# EAGLE design batteryBalancer (EAGLE 8.4.0)
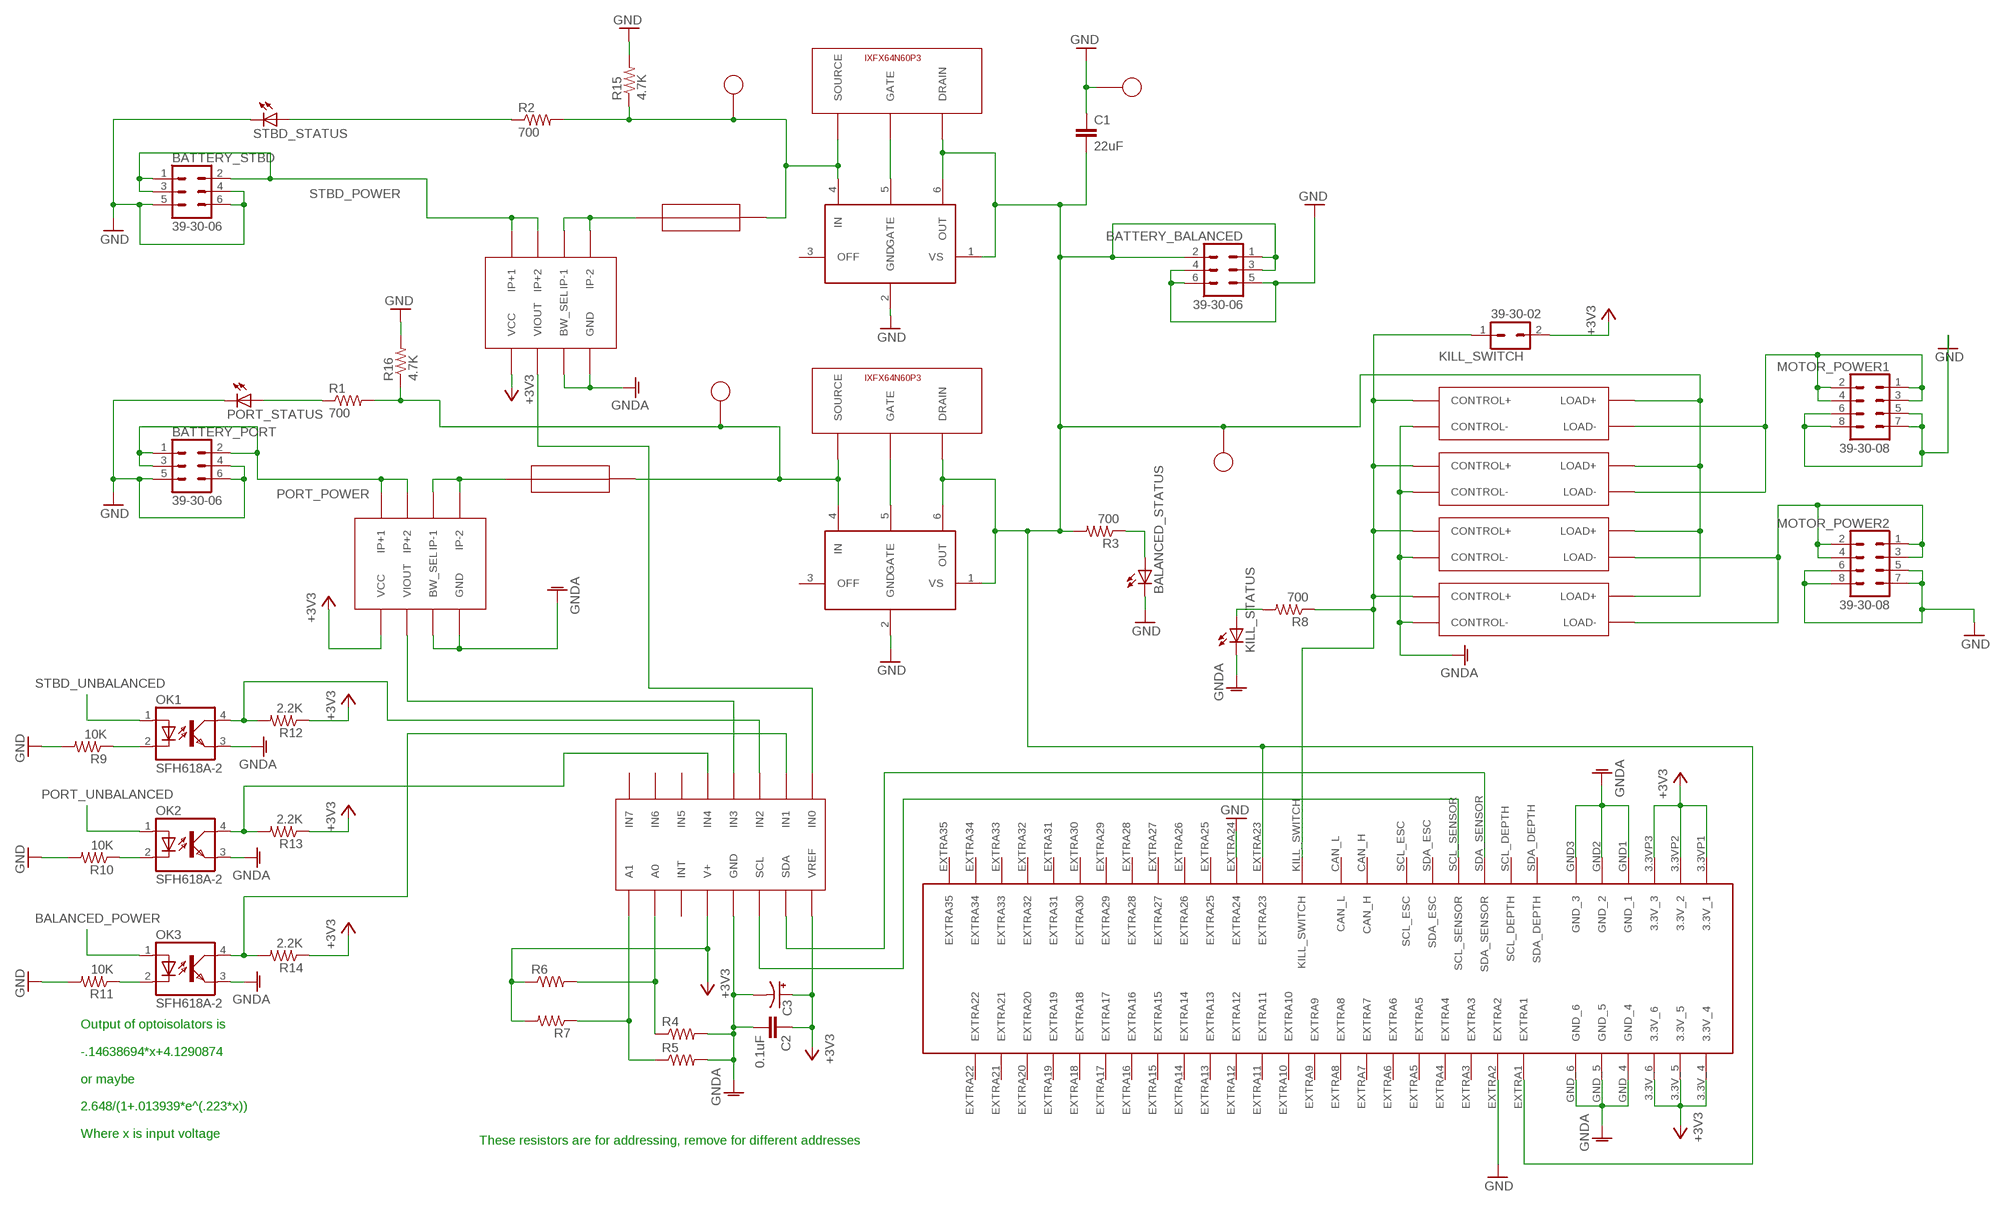
[diagram p0: schematic, sheet 1]

## Parts
ADC  ADC128D818  [TSSOP-16]
BALANCED_STATUS  LTST-S270GKT  [LTST-S270GKT]
BATTERY_BALANCED  39-30-06  [39-30-?06?]
BATTERY_PORT  39-30-06  [39-30-?06?]
BATTERY_STBD  39-30-06  [39-30-?06?]
C1  22uF  0.1UF-KIT-EZ-50V-20%  [CAP-PTH-SMALL-KIT]
C2  0.1uF  0.1UF-KIT-EZ-50V-20%  [CAP-PTH-SMALL-KIT]
C3  CPOL-USE2-4  [E2-4]
EDGE_CONNECTOR  5530843  [5530843-6-BOARDFINGERS]
KILL_STATUS  LTST-S270GKT  [LTST-S270GKT]
KILL_SWITCH  39-30-02  [39-30-?02?]
MOTOR_POWER1  39-30-08  [39-30-?08?]
MOTOR_POWER2  39-30-08  [39-30-?08?]
OK1  SFH618A-2  [DIP4]
OK2  SFH618A-2  [DIP4]
OK3  SFH618A-2  [DIP4]
PORT_CS  ACS722  [SOIC-8]
PORT_FC  LM5050-1  [SOT23-6]
PORT_FET  IXFX64N60P3  [IXFX64N60P3]
PORT_FUSE  01220083Z  [01220083Z]
PORT_STATUS  LTST-S270GKT  [LTST-S270GKT]
R1  700  R-US_0207/7  [0207/7]
R2  700  R-US_0207/7  [0207/7]
R3  700  R-US_0207/7  [0207/7]
R4  R-US_0204/5  [0204/5]
R5  R-US_0204/5  [0204/5]
R6  R-US_0204/5  [0204/5]
R7  R-US_0204/5  [0204/5]
R8  700  R-US_0207/7  [0207/7]
R9  10K  R-US_0207/7  [0207/7]
R10  10K  R-US_0207/7  [0207/7]
R11  10K  R-US_0207/7  [0207/7]
R12  2.2K  R-US_0207/7  [0207/7]
R13  2.2K  R-US_0207/7  [0207/7]
R14  2.2K  R-US_0207/7  [0207/7]
R15  4.7K  R-US_0207/7  [0207/7]
R16  4.7K  R-US_0207/7  [0207/7]
RELAY2  CMX60D20  [CMX60D20]
RELAY3  CMX60D20  [CMX60D20]
RELAY4  CMX60D20  [CMX60D20]
RLAY1  CMX60D20  [CMX60D20]
STBD_CS  ACS722  [SOIC-8]
STBD_FC  LM5050-1  [SOT23-6]
STBD_FET  IXFX64N60P3  [IXFX64N60P3]
STBD_FUSE  01220083Z  [01220083Z]
STBD_STATUS  LTST-S270GKT  [LTST-S270GKT]
U$1  5010_C  [5010_C]
U$2  5010_C  [5010_C]
U$3  5010_C  [5010_C]
U$4  5010_C  [5010_C]

## Nets
3.3V: ADC.V+ ADC.VREF C2.1 C3.+ EDGE_CONNECTOR.3.3V_4 EDGE_CONNECTOR.3.3V_5 EDGE_CONNECTOR.3.3V_6 EDGE_CONNECTOR.3.3VP1(3.3V_1) EDGE_CONNECTOR.3.3VP2(3.3V_2) EDGE_CONNECTOR.3.3VP3(3.3V_3) KILL_SWITCH.2 PORT_CS.VCC R6.1 R7.2 R12.1 R13.1 R14.1 STBD_CS.VCC ; supply symbol labelled +3V3
ADC_A0: ADC.A0 R4.1 R6.2
ADC_A1: ADC.A1 R5.1 R7.1
BALANCED_INDICATOR: BALANCED_STATUS.ANODE(A) R3.1
BALANCED_LOGIC: ADC.IN1 OK3.4(COL) R14.2
BALANCED_OPTO_NEG: OK3.2(C) R11.1
BALANCED_POWER: BATTERY_BALANCED.1 BATTERY_BALANCED.2 BATTERY_BALANCED.3 C1.2 EDGE_CONNECTOR.EXTRA1 EDGE_CONNECTOR.EXTRA23 OK3.1(A) PORT_FC.1(VS) PORT_FC.6(OUT) PORT_FET.DRAIN R3.2 RELAY2.LOAD+ RELAY3.LOAD+ RELAY4.LOAD+ RLAY1.LOAD+ STBD_FC.1(VS) STBD_FC.6(OUT) STBD_FET.DRAIN U$3.P$1
GND: BALANCED_STATUS.CATHODE(C) BATTERY_BALANCED.4 BATTERY_BALANCED.5 BATTERY_BALANCED.6 BATTERY_PORT.4 BATTERY_PORT.5 BATTERY_PORT.6 BATTERY_STBD.4 BATTERY_STBD.5 BATTERY_STBD.6 C1.1 EDGE_CONNECTOR.EXTRA2 EDGE_CONNECTOR.EXTRA24 MOTOR_POWER1.5 MOTOR_POWER1.6 MOTOR_POWER1.7 MOTOR_POWER1.8 MOTOR_POWER2.5 MOTOR_POWER2.6 MOTOR_POWER2.7 MOTOR_POWER2.8 PORT_FC.2(GND) PORT_STATUS.CATHODE(C) R9.2 R10.2 R11.2 R15.2 R16.2 STBD_FC.2(GND) STBD_STATUS.CATHODE(C) U$4.P$1
KILL_SWITCH: EDGE_CONNECTOR.KILL_SWITCH KILL_SWITCH.1 R8.1 RELAY2.CONTROL+ RELAY3.CONTROL+ RELAY4.CONTROL+ RLAY1.CONTROL+
LOGIC_GND: ADC.GND C2.2 C3.- EDGE_CONNECTOR.GND1(GND_1) EDGE_CONNECTOR.GND2(GND_2) EDGE_CONNECTOR.GND3(GND_3) EDGE_CONNECTOR.GND_4 EDGE_CONNECTOR.GND_5 EDGE_CONNECTOR.GND_6 KILL_STATUS.CATHODE(C) OK1.3(EMIT) OK2.3(EMIT) OK3.3(EMIT) PORT_CS.BW_SEL PORT_CS.GND R4.2 R5.2 RELAY2.CONTROL- RELAY3.CONTROL- RELAY4.CONTROL- RLAY1.CONTROL- STBD_CS.BW_SEL STBD_CS.GND ; supply symbol labelled GNDA
MOTOR_POWER1: MOTOR_POWER1.1 MOTOR_POWER1.2 MOTOR_POWER1.3 MOTOR_POWER1.4 RELAY2.LOAD- RLAY1.LOAD-
MOTOR_POWER2: MOTOR_POWER2.1 MOTOR_POWER2.2 MOTOR_POWER2.3 MOTOR_POWER2.4 RELAY3.LOAD- RELAY4.LOAD-
N$3: KILL_STATUS.ANODE(A) R8.2
PORT_CURRENT: ADC.IN3 PORT_CS.VIOUT
PORT_GATE: PORT_FC.5(GATE) PORT_FET.GATE
PORT_LOGIC: ADC.IN4 OK2.4(COL) R13.2
PORT_OPTO_NEG: OK2.2(C) R10.1
PORT_POWER: BATTERY_PORT.1 BATTERY_PORT.2 BATTERY_PORT.3 PORT_CS.IP+1 PORT_CS.IP+2
PORT_STATUS: PORT_STATUS.ANODE(A) R1.1
PORT_UNBALANCED: OK2.1(A) PORT_FC.4(IN) PORT_FET.SOURCE PORT_FUSE.P$3 PORT_FUSE.P$4 R1.2 R16.1 U$2.P$1
PORT_UNFUSED: PORT_CS.IP-1 PORT_CS.IP-2 PORT_FUSE.P$1 PORT_FUSE.P$2
SCL: ADC.SCL EDGE_CONNECTOR.SCL_SENSOR
SDA: ADC.SDA EDGE_CONNECTOR.SDA_SENSOR
STBD_CURRENT: ADC.IN0 STBD_CS.VIOUT
STBD_GATE: STBD_FC.5(GATE) STBD_FET.GATE
STBD_LOGIC: ADC.IN2 OK1.4(COL) R12.2
STBD_OPTO_NEG: OK1.2(C) R9.1
STBD_POWER: BATTERY_STBD.1 BATTERY_STBD.2 BATTERY_STBD.3 STBD_CS.IP+1 STBD_CS.IP+2
STBD_STATUS: R2.1 STBD_STATUS.ANODE(A)
STBD_UNBALANCED: OK1.1(A) R2.2 R15.1 STBD_FC.4(IN) STBD_FET.SOURCE STBD_FUSE.P$3 STBD_FUSE.P$4 U$1.P$1
STBD_UNFUSED: STBD_CS.IP-1 STBD_CS.IP-2 STBD_FUSE.P$1 STBD_FUSE.P$2
Unconnected: ADC.IN5 ADC.IN6 ADC.IN7 ADC.INT EDGE_CONNECTOR.CAN_H EDGE_CONNECTOR.CAN_L EDGE_CONNECTOR.EXTRA3 EDGE_CONNECTOR.EXTRA4 EDGE_CONNECTOR.EXTRA5 EDGE_CONNECTOR.EXTRA6 EDGE_CONNECTOR.EXTRA7 EDGE_CONNECTOR.EXTRA8 EDGE_CONNECTOR.EXTRA9 EDGE_CONNECTOR.EXTRA10 EDGE_CONNECTOR.EXTRA11 EDGE_CONNECTOR.EXTRA12 EDGE_CONNECTOR.EXTRA13 EDGE_CONNECTOR.EXTRA14 EDGE_CONNECTOR.EXTRA15 EDGE_CONNECTOR.EXTRA16 EDGE_CONNECTOR.EXTRA17 EDGE_CONNECTOR.EXTRA18 EDGE_CONNECTOR.EXTRA19 EDGE_CONNECTOR.EXTRA20 EDGE_CONNECTOR.EXTRA21 EDGE_CONNECTOR.EXTRA22 EDGE_CONNECTOR.EXTRA25 EDGE_CONNECTOR.EXTRA26 EDGE_CONNECTOR.EXTRA27 EDGE_CONNECTOR.EXTRA28 EDGE_CONNECTOR.EXTRA29 EDGE_CONNECTOR.EXTRA30 EDGE_CONNECTOR.EXTRA31 EDGE_CONNECTOR.EXTRA32 EDGE_CONNECTOR.EXTRA33 EDGE_CONNECTOR.EXTRA34 EDGE_CONNECTOR.EXTRA35 EDGE_CONNECTOR.SCL_DEPTH EDGE_CONNECTOR.SCL_ESC EDGE_CONNECTOR.SDA_DEPTH EDGE_CONNECTOR.SDA_ESC PORT_FC.3(OFF) STBD_FC.3(OFF)

## Notes on the sheet
- Output of optoisolators is
  
  -.14638694*x+4.1290874
  
  or maybe
  
  2.648/(1+.013939*e^(.223*x))
  
  Where x is input voltage
- These resistors are for addressing, remove for different addresses

## Library data of the parts
ADC = ADC128D818:ADC128D818
BALANCED_STATUS KILL_STATUS PORT_STATUS STBD_STATUS = LTST-S270GKT:LTST-S270GKT
BATTERY_BALANCED BATTERY_PORT BATTERY_STBD = con-molex-mini-fit:39-30-?06?: HEADER
C1 = SparkFun-Capacitors:0.1UF: 0.1µF ceramic capacitors A capacitor is a passive two-terminal electrical component used to store electrical energy temporarily in an electric field.; PROD_ID: CAP-08370; VALUE: 0.1uF
C2 = SparkFun-Capacitors:0.1UF: 0.1µF ceramic capacitors A capacitor is a passive two-terminal electrical component used to store electrical energy temporarily in an electric field.; PROD_ID: CAP-08370
C3 = rcl:CPOL-US: POLARIZED CAPACITOR, American symbol
EDGE_CONNECTOR = 5530843-6:5530843
KILL_SWITCH = con-molex-mini-fit:39-30-?02?: HEADER
MOTOR_POWER1 MOTOR_POWER2 = con-molex-mini-fit:39-30-?08?: HEADER
OK1-OK3 = optocoupler:SFH618?*: Optocoupler, Phototransistor Output, Low Input Current Source: Data sheet <http://www.vishay.com/docs/83673/sfh618.pdf>; MF: VISHAY/TELEFUNKEN; MPN: SFH618A-2; OC_FARNELL: 6424855; OC_NEWARK: 21H7744
PORT_CS STBD_CS = ACS722:ACS722
PORT_FC STBD_FC = lio:LM5050-1
PORT_FET STBD_FET = IXFX64N60P3:IXFX64N60P3
PORT_FUSE STBD_FUSE = 01220083Z:01220083Z
R1-R3 R8-R16 = rcl:R-US_: RESISTOR, American symbol
R4-R7 = resistor:R-US_: RESISTOR, American symbol
RELAY2-RELAY4 RLAY1 = CMX60D20:CMX60D20
U$1-U$4 = 5010_c:5010_C

## Board
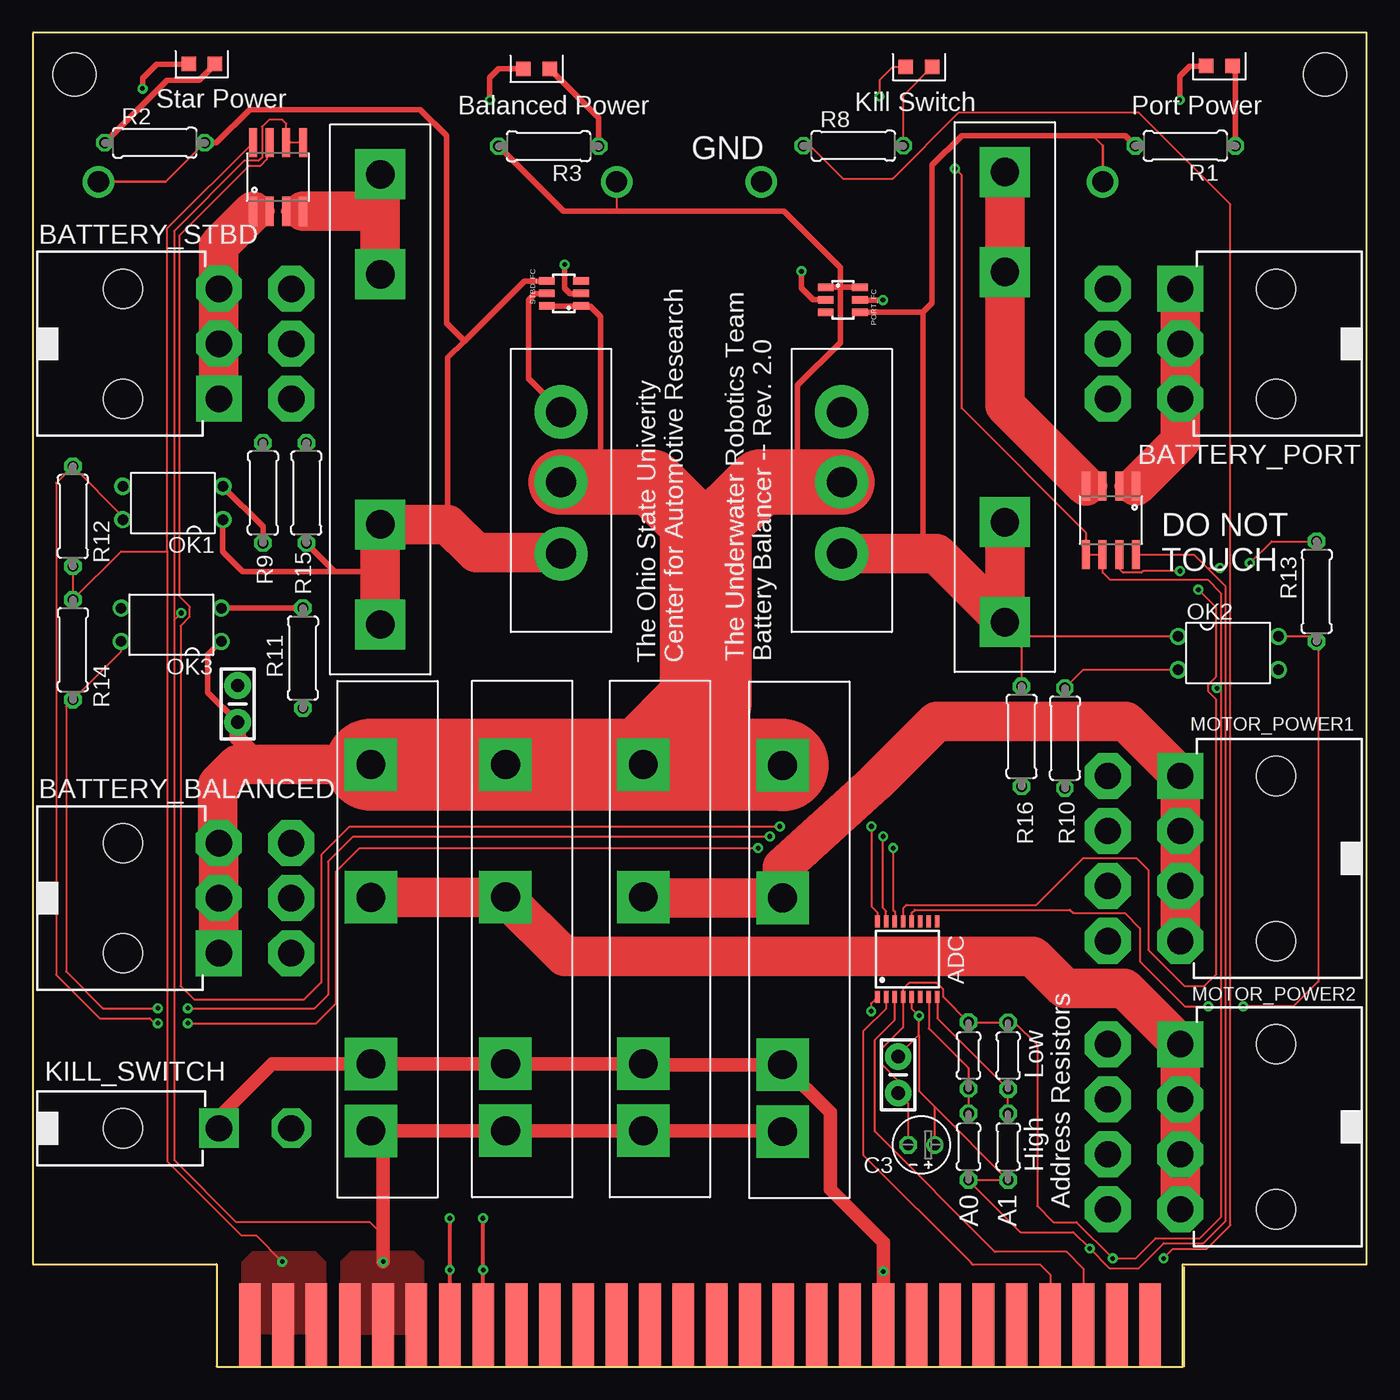
[diagram p1: board, top side]
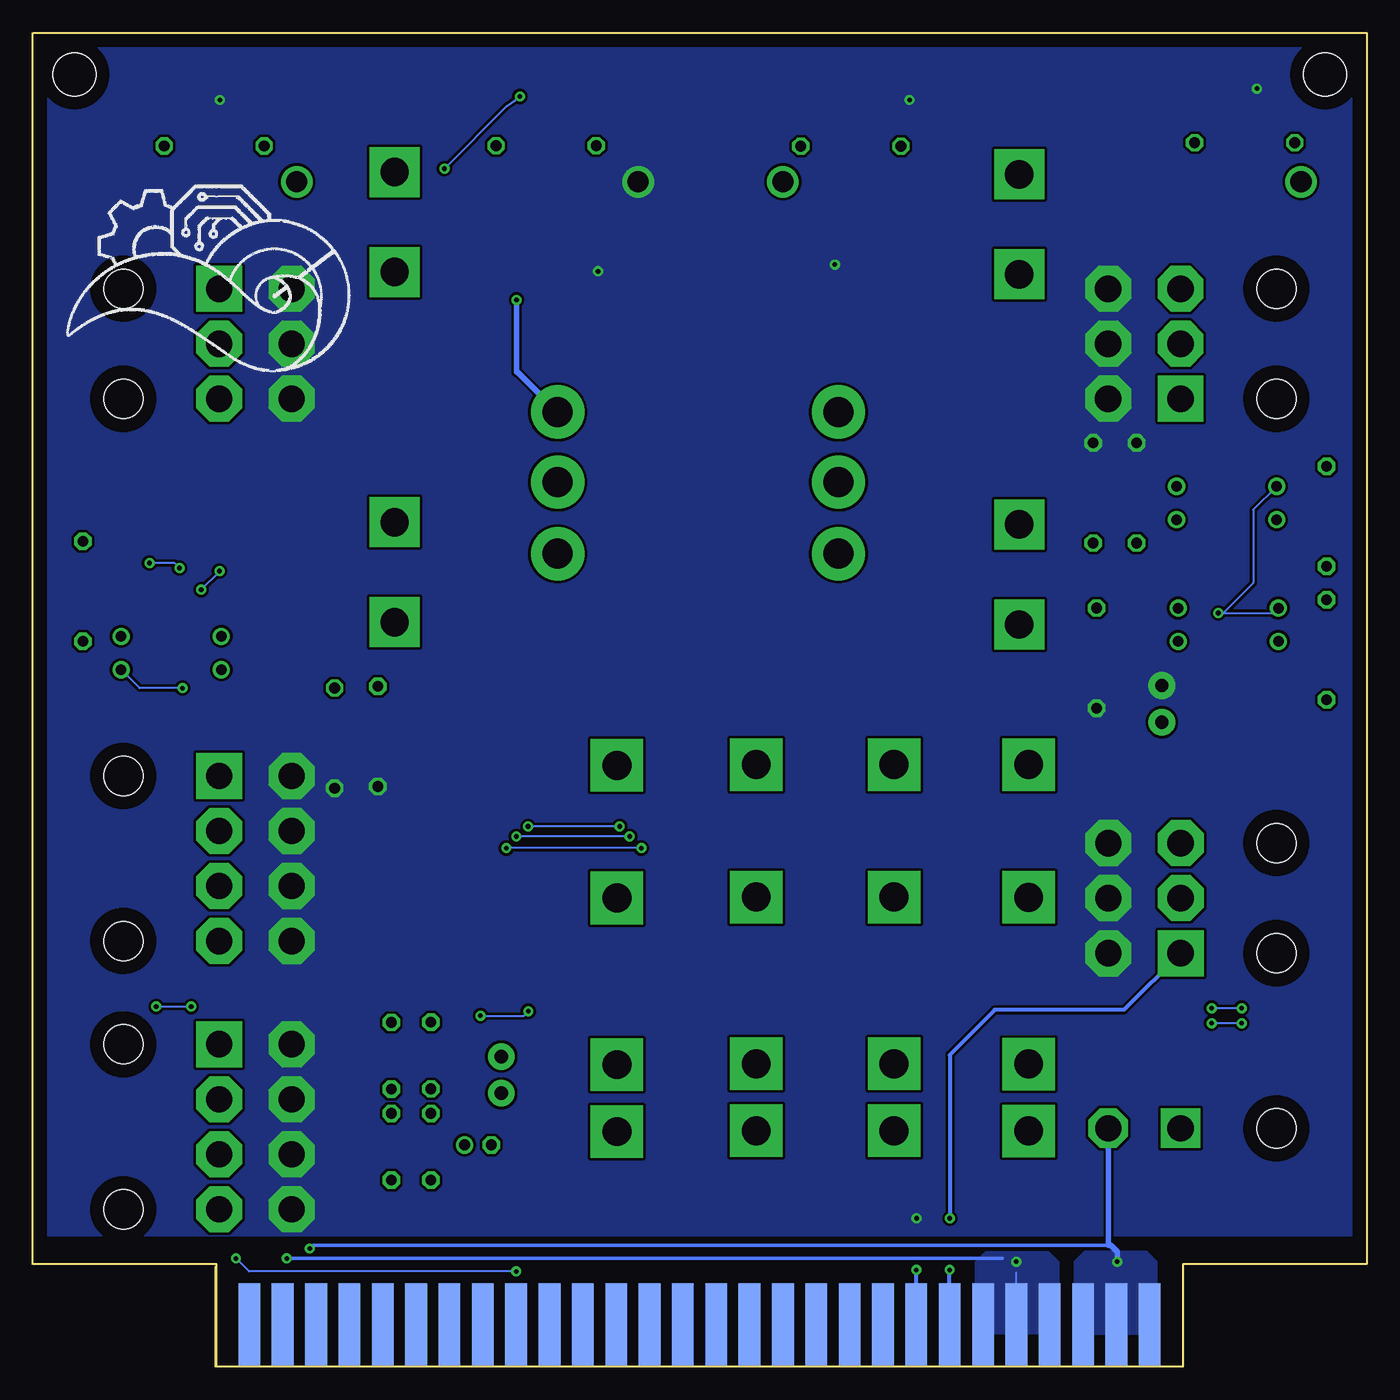
[diagram p2: board, bottom side, seen from below]

Size 101.6 x 101.6 mm. Coordinates in mm from the lower left corner, seen from the top.
Outline: 14,0 87.6,0 87.6,7.8 101.6,7.8 101.6,101.6 0,101.6 0,7.8 14,7.8 14,0
Copper layers (1*16): Top 0.035mm / dielectric 1.5mm / Bottom 0.035mm
Design rules "battery_balancer": minimum track width 6mil, minimum drill 0.35mm, track to track 0.205mm, track to pad 0.205mm, pad to pad 0.205mm, via to via 0.205mm, smd to smd 6mil, copper to edge 40mil, drill to drill 6mil, minimum pad ring 10mil, minimum via ring 8mil, stop-mask expansion 4mil, vias tented up to drill 0mil, thermal gap 10mil
Holes 3.26 mm at 3.17,98.42 98.42,98.42

### Footprints (pad centres in the part's own frame; a part is rotated, then mirrored left to right if it is on the bottom)
TSSOP-16 = smd 0.9 x 0.35: A0 -2.875,-1.625; A1 -2.875,-2.275; GND -2.875,0.325; IN0 2.875,2.275; IN1 2.875,1.625; IN2 2.875,0.975; IN3 2.875,0.325; IN4 2.875,-0.325; IN5 2.875,-0.975; IN6 2.875,-1.625; IN7 2.875,-2.275; INT -2.875,-0.975; SCL -2.875,0.975; SDA -2.875,1.625; V+ -2.875,-0.325; VREF -2.875,2.275
LTST-S270GKT = smd 1.1 x 1.1: ANODE 1,0; CATHODE -1,0
39-30-?06? = drill 2 pad 3.5 square: 1 4.191,0 | drill 2 pad 3.5 octagon: 2 0,0; 3 -4.191,0; 4 4.191,5.512; 5 0,5.512; 6 -4.191,5.512 | hole 3: -4.191,-7.3; 4.191,-7.3
CAP-PTH-SMALL-KIT = drill 1.016 pad 2.032: 1 -1.397,0; 2 1.397,0
E2-4 = drill 0.813 pad 1.27: + -1.016,0 | drill 0.813 pad 1.27 octagon: - 1.016,0
5530843-6-BOARDFINGERS = smd 1.651 x 6.35 bottom: 3.3V_4 0.826,3.175; 3.3V_5 3.365,3.175; 3.3V_6 5.905,3.175; EXTRA1 16.066,3.175; EXTRA2 18.605,3.175; EXTRA3 21.145,3.175; EXTRA4 23.686,3.175; EXTRA5 26.226,3.175; EXTRA6 28.765,3.175; EXTRA7 31.305,3.175; EXTRA8 33.846,3.175; EXTRA9 36.386,3.175; EXTRA10 38.925,3.175; EXTRA11 41.465,3.175; EXTRA12 44.005,3.175; EXTRA13 46.545,3.175; EXTRA14 49.086,3.175; EXTRA15 51.626,3.175; EXTRA16 54.166,3.175; EXTRA17 56.706,3.175; EXTRA18 59.245,3.175; EXTRA19 61.785,3.175; EXTRA20 64.326,3.175; EXTRA21 66.865,3.175; EXTRA22 69.406,3.175; GND_4 8.445,3.175; GND_5 10.986,3.175; GND_6 13.525,3.175 | smd 1.651 x 6.35: 3.3VP1 0.826,3.175; 3.3VP2 3.365,3.175; 3.3VP3 5.905,3.175; CAN_H 51.626,3.175; CAN_L 54.166,3.175; EXTRA23 16.066,3.175; EXTRA24 18.605,3.175; EXTRA25 21.145,3.175; EXTRA26 23.686,3.175; EXTRA27 26.226,3.175; EXTRA28 28.765,3.175; EXTRA29 31.305,3.175; EXTRA30 33.846,3.175; EXTRA31 36.386,3.175; EXTRA32 38.925,3.175; EXTRA33 41.465,3.175; EXTRA34 44.005,3.175; EXTRA35 46.545,3.175; GND1 8.445,3.175; GND2 10.986,3.175; GND3 13.525,3.175; KILL_SWITCH 49.086,3.175; SCL_DEPTH 59.245,3.175; SCL_ESC 69.406,3.175; SCL_SENSOR 64.326,3.175; SDA_DEPTH 56.706,3.175; SDA_ESC 66.865,3.175; SDA_SENSOR 61.785,3.175
39-30-?02? = drill 2 pad 3 square: 1 0,0 | drill 2 pad 3 octagon: 2 0,5.512 | hole 3: 0,-7.3
39-30-?08? = drill 2 pad 3.5 square: 1 6.287,0 | drill 2 pad 3.5 octagon: 2 2.095,0; 3 -2.095,0; 4 -6.287,0; 5 6.287,5.512; 6 2.095,5.512; 7 -2.095,5.512; 8 -6.287,5.512 | hole 3: -6.287,-7.3; 6.287,-7.3
DIP4 = drill 0.8: 1 -1.27,-3.81; 2 1.27,-3.81; 3 1.27,3.81; 4 -1.27,3.81
SOIC-8 = smd 0.61 x 2.21: BW_SEL 0.635,2.616; GND 1.905,2.616; IP+1 -1.905,-2.616; IP+2 -0.635,-2.616; IP-1 0.635,-2.616; IP-2 1.905,-2.616; VCC -1.905,2.616; VIOUT -0.635,2.616
SOT23-6 = smd 0.55 x 1.2: 1 -0.95,-1.3; 2 0,-1.3; 3 0.95,-1.3; 4 0.95,1.3; 5 0,1.3; 6 -0.95,1.3
IXFX64N60P3 = drill 2.286 pad 4.064: DRAIN -1.27,0; GATE -6.604,0; SOURCE 4.191,0
01220083Z = drill 2.159 pad 3.81 square: P$1 -16.51,0; P$2 -8.89,0; P$3 10.16,0; P$4 17.78,0
0207/7 = drill 0.813 octagon: 1 -3.81,0; 2 3.81,0
0204/5 = drill 0.813 octagon: 1 -2.54,0; 2 2.54,0
CMX60D20 = drill 2.2 pad 4 square: CONTROL+ -8.87,0; CONTROL- -13.97,0; LOAD+ 13.93,0; LOAD- 3.83,0
5010_C = drill 1.6 pad 2.286: P$1 0,0

### Placement (x,y rotation side)
ADC  66.61,31.04 90 top
BALANCED_STATUS  38.38,98.86 0 top
BATTERY_BALANCED  39-30-06?  [39-30-?06?]  14.17,35.69 270 top
BATTERY_PORT  39-30-06?  [39-30-?06?]  87.4,77.91 90 top
BATTERY_STBD  39-30-06?  [39-30-?06?]  14.18,77.91 270 top
C1  15.6,50.49 270 top
C2  65.91,22.23 270 top
C3  67.69,16.89 180 top
EDGE_CONNECTOR  15.7,0 0 top
KILL_STATUS  67.5,99 0 top
KILL_SWITCH  39-30-02?  [39-30-?02?]  14.17,18.16 270 top
MOTOR_POWER1  39-30-08?  [39-30-?08?]  87.4,38.71 90 top
MOTOR_POWER2  39-30-08?  [39-30-?08?]  87.4,18.27 90 top
OK1  10.67,65.79 90 top
OK2  91.06,54.36 270 top
OK3  10.54,56.52 90 top
PORT_CS  82.11,64.47 180 top
PORT_FC  61.7,81.26 270 top
PORT_FET  61.62,66.11 270 top
PORT_FUSE  74.04,74.49 270 top
PORT_STATUS  90.38,99.06 0 top
R1  87.79,92.99 180 top
R2  9.29,93.22 0 top
R3  39.29,92.96 180 top
R4  71.28,23.7 90 top
R5  74.29,23.69 90 top
R6  71.28,16.75 90 top
R7  74.29,16.75 270 top
R8  62.5,93 0 top
R9  17.53,66.55 90 top
R10  78.61,47.88 270 top
R11  20.57,53.98 270 top
R12  3.05,64.77 90 top
R13  97.79,59.05 270 top
R14  3.05,54.61 270 top
R15  20.83,66.55 90 top
R16  75.31,48.01 270 top
RELAY2  46.5,31.94 90 top
RELAY3  36,31.94 90 top
RELAY4  25.75,31.93 90 top
RLAY1  57.11,31.88 90 top
STBD_CS  18.68,90.61 0 top
STBD_FC  40.45,81.75 90 top
STBD_FET  40.24,66.11 270 top
STBD_FUSE  26.46,74.31 270 top
STBD_STATUS  12.88,99.21 0 top
U$1  5,90.25 0 top
U$2  81.5,90.25 0 top
U$3  44.46,90.25 0 top
U$4  55.5,90.25 0 top

### Tracks (layer width: path | path; a pad name or v marks a point on that pad's centre or on a via)
3.3V  (via drill 0.35)
  Top 0.152: 19.07,7.93 v19,8 17,10 15.88,10 10.25,15.62 10.25,62.1 | 68.71,19.79 67.5,21 67.5,25.27 | 68.71,19.79 R7.2 R6.1 75.23,10.25 79.25,10.25 v80.5,9 82,7.5 84.25,7.5 86.15,9.4 89.15,9.4 90.86,11.1 90.86,59.44 89.46,60.83 | ADC.V+ 66.93,27.3 v67.5,26.73 67.5,25.27 | 10.25,62.1 10.25,86.71 STBD_CS.VCC | R12.1 R14.1 6.73,62.1 10.25,62.1 | C3.+ 68.71,19.79 | v63.86,27.07 63.86,27.68 ADC.VREF | C2.1 65.91,23.69 67.5,25.27 | PORT_CS.VCC 88.44,61.86 89.46,60.83 | 89.46,60.83 v90.42,60.83 | v92.71,61.21 94.36,62.87 R13.1
  Bottom 0.152: 19.51,9.26 19.5,9.25 | v67.5,26.73 64.2,26.73 v63.86,27.07 | v90.42,60.83 90.81,61.21 v92.71,61.21
  Bottom 0.254: v80.5,9 80.25,9.25 19.68,9.25
  Bottom 0.406: v19,8 19,8.75 19.5,9.25 19.68,9.25 KILL_SWITCH.2
  pour Bottom (no thermals): 16.75,8.75 21.5,8.75 22.25,8 22.25,2.75 22,2.5 16.25,2.5 16,2.75 16,8
  pour Top (no thermals): 22.25,2.75 22,2.5 16.25,2.5 16,2.75 16,8 16.75,8.75 21.5,8.75 22.25,8
ADC_A0
  Top 0.152: R6.2 R4.1 71.25,21.2 71.25,22.75 68.24,25.76 ADC.A0
ADC_A1
  Top 0.152: ADC.A1 68.89,26.55 R5.1 R7.1
BALANCED_INDICATOR
  Top 0.406: R3.1 43.1,95.14 BALANCED_STATUS.ANODE
BALANCED_LOGIC  (via drill 0.35)
  Top 0.152: OK3.4 6.73,54.48 R14.2 2.54,50.29 2.54,30.1 5.33,27.3 v9.53,27.3 | v11.81,27.3 21.46,27.3 22.48,28.32 22.48,38.48 24.38,40.39 v56.13,40.39 | v64.77,40.39 64.77,34.92 64.99,34.71 ADC.IN1
  Bottom 0.152: v9.53,27.3 v11.81,27.3 | v56.13,40.39 v64.77,40.39
BALANCED_OPTO_NEG
  Top 0.406: R11.1 OK3.2
BALANCED_POWER  (via drill 0.35)
  Top 0.152: 55.38,69.62 55.38,67.38 | 43.32,67.82 43.75,67.38 | 59.25,67.88 58.75,67.38 | U$3.P$1 44.46,88.01 44.45,88
  Top 0.203: 41.8,80.75 41.77,80.78 STBD_FC.1 | 54.63,69.62 55.38,69.62
  Top 0.305: EDGE_CONNECTOR.EXTRA1 v31.77,7.37 31.77,11.29 v31.75,11.3
  Top 0.406: STBD_FC.1 42.45,80.8 43.25,80 43.25,67.88 43.32,67.82 | STBD_FC.6 39.17,80.78 41.77,80.78 | 61.5,82.21 PORT_FC.1 | 61.5,82.21 PORT_FC.6 | 61.5,82.21 61.5,78 58.25,74.75 58.25,67.88 58.75,67.38 | 61.5,82.21 61.5,83.71 57.21,88 44.45,88 40.44,88 R3.2 | C1.2 13.34,51.36 13.34,54.23 OK3.1
  Top 1.27: C1.2 15.6,47.91 17.65,45.85
  Top 3: BATTERY_BALANCED.1 BATTERY_BALANCED.2 BATTERY_BALANCED.3 14.1,39.95 14.1,44.35 15.61,45.85 17.65,45.85 RELAY4.LOAD+
  Top 5: STBD_FET.DRAIN 43.75,67.38 47.12,67.38 51.25,63.25 55.38,67.38 58.75,67.38 PORT_FET.DRAIN
  Top 7: RELAY4.LOAD+ 25.76,45.87 RELAY3.LOAD+ RELAY2.LOAD+ | RELAY2.LOAD+ 57.05,45.87 RLAY1.LOAD+ | RELAY2.LOAD+ 51.25,50.62 51.25,63.25
  Bottom 0.305: BATTERY_BALANCED.1 18.49,27.18 28.32,27.18 31.75,23.75 v31.75,11.3 | EDGE_CONNECTOR.EXTRA1 v31.77,7.37
GND  (via drill 0.35)
  Top 0.305: EDGE_CONNECTOR.EXTRA24 v34.31,7.37 34.31,11.29 v34.29,11.3
  Top 0.406: PORT_STATUS.CATHODE 88.14,99.06 87.38,98.3 87.38,96.51 v87.35,96.49 | BALANCED_STATUS.CATHODE 35.49,98.86 34.8,98.17 34.8,96.52 v34.83,96.49 | STBD_STATUS.CATHODE 9.42,99.21 8.35,98.14 v8.35,97.35 | v58.55,83.44 58.55,82.17 59.44,81.28 60.38,81.28 PORT_FC.2 | STBD_FC.2 40.93,81.75 40.51,82.17 v40.51,83.95
  Bottom 0.305: EDGE_CONNECTOR.EXTRA24 v34.31,7.37
  pour Bottom (no thermals): 0,101.5 101.5,101.5 101.5,10 0,10
KILL_SWITCH  (via drill 0.35)
  Top 0.152: R8.1 59.19,93 61.69,90.5 65.5,90.5 70.5,95.5 84.25,95.5 91.22,88.53 91.22,10.78 89.41,8.97 86.85,8.97 v86.13,8.25
  Top 1.016: EDGE_CONNECTOR.KILL_SWITCH v64.78,7.25 64.78,9.46 60.75,13.5 60.75,19.37 RLAY1.CONTROL+ 46.56,23 RELAY2.CONTROL+ RELAY3.CONTROL+ 35.99,23.05 RELAY4.CONTROL+ 18.23,23.05 14.17,19 KILL_SWITCH.1
  Bottom 0.152: v86.13,8.25 85.13,7.25 v64.78,7.25
LOGIC_GND  (via drill 0.35)
  Top 0.152: 26.5,3.17 EDGE_CONNECTOR.GND2 | v70.25,91.25 70.75,90.75 70.75,73 80.21,63.54 PORT_CS.GND PORT_CS.BW_SEL 81.5,61.84 81.5,60.49 82.04,59.94 89.48,59.94 90.5,58.93 90.5,51.39 | v64.5,96.75 64.5,98 65.5,99 KILL_STATUS.CATHODE | STBD_CS.GND STBD_CS.BW_SEL 19.31,94.69 19,95 18,95 17.45,94.45 17.45,92.11 17.19,91.84 16.09,91.84 10.75,86.5 10.75,56.9 | 26.69,10 25.69,11 15.5,11 10.75,15.75 10.75,56.9 | 10.75,56.9 10.79,56.9 v11.3,57.4 | C3.- 66.67,20.07 C2.2 65.91,21.79 64.62,23.09 64.62,24.16 66.29,25.83 ADC.GND 66.29,28.76 66.75,29.22 68.85,29.22 69.34,28.73 69.34,28.18 R4.2 71.3,26.23 R5.2 74.77,26.23 76.5,24.5 76.5,12.25 77.75,11 79.5,11 v82.25,8.25 84,8.25 85.53,9.78 88.9,9.78 90.5,11.38 90.5,51.39 | v90.2,51.69 90.5,51.39
  Top 1.016: RLAY1.CONTROL- 57.05,17.97 RELAY2.CONTROL- RELAY3.CONTROL- 35.99,17.95 27.43,17.95 | v26.69,8 26.69,10 26.69,17.21 27.43,17.95 | RELAY4.CONTROL- 27.43,17.95
  Bottom 0.152: EDGE_CONNECTOR.GND2 26.69,7.19 | v64.5,96.75 65.5,96 v70.25,91.25 | OK3.3 7.11,57.4 v11.3,57.4 10.92,57.4 8.64,59.69 8.64,65.28 OK1.3 | 71.28,26.19 R4.2 | v90.2,51.69 93.47,51.69 OK2.3
  Bottom 0.254: 27.75,8.25 v82.25,8.25
  pour Top (no thermals): 23.5,2.75 23.75,2.5 29.25,2.5 29.5,2.5 29.75,2.75 29.75,8 29,8.75 24.25,8.75 23.5,8
  pour Bottom (no thermals): 23.5,2.75 23.75,2.5 29.5,2.5 29.75,2.75 29.75,8 29,8.75 24.5,8.75 24.25,8.75 23.5,8
MOTOR_POWER1
  Top 3: RELAY2.LOAD- 46.56,35.7 RLAY1.LOAD- 57.11,38.06 64.14,44.45 68.83,49.15 83.24,49.15 MOTOR_POWER1.1 MOTOR_POWER1.2 MOTOR_POWER1.3 MOTOR_POWER1.4
MOTOR_POWER2
  Top 3: 35.99,35.76 RELAY4.LOAD- | 35.99,35.76 RELAY3.LOAD- | 35.99,35.76 40.49,31.25 76.19,31.25 78.61,28.83 83.13,28.83 MOTOR_POWER2.1 MOTOR_POWER2.2 MOTOR_POWER2.3 MOTOR_POWER2.4
N$3
  Top 0.152: R8.2 66.31,96.81 KILL_STATUS.ANODE
PORT_CURRENT  (via drill 0.35)
  Top 0.152: ADC.IN3 66.29,34.92 66.55,35.18 76.45,35.18 80.01,38.73 84.07,38.73 84.96,37.85 84.96,31.75 87.71,29 89.25,29 90.14,29.89 90.14,50.81 89.54,51.42 89.54,51.96 90.14,52.57 90.14,57.81 v88.77,59.18 | v87.38,60.6 84.57,60.6 84.44,60.47 83.08,60.47 83.06,60.45 82.75,60.76 PORT_CS.VIOUT
  Bottom 0.152: v88.77,59.18 87.38,60.58 v87.38,60.6
PORT_GATE  (via drill 0.35)
  Top 0.406: PORT_FC.5 63.01,81.25 v64.75,81.25
  Bottom 0.406: v64.75,81.25 64.75,75.75 64.66,75.75 PORT_FET.GATE
PORT_LOGIC  (via drill 0.35)
  Top 0.152: v92.2,27.43 96.01,27.43 97.92,29.34 97.92,55.12 R13.2 97.41,55.63 OK2.4 | ADC.IN4 66.94,34.55 67.18,34.8 78.99,34.8 79.25,34.54 83.19,34.54 84.33,33.4 84.33,30.86 87.76,27.43 v89.53,27.43
  Bottom 0.152: v92.2,27.43 v89.53,27.43
PORT_OPTO_NEG
  Top 0.152: R10.1 80.01,53.09 OK2.2
PORT_POWER
  Top 0.813: PORT_CS.IP+2 PORT_CS.IP+1
  Top 3: BATTERY_PORT.1 BATTERY_PORT.2 BATTERY_PORT.3 87.4,70.47 PORT_CS.IP+1
PORT_STATUS
  Top 0.406: R1.1 91.6,98.84 PORT_STATUS.ANODE
PORT_UNBALANCED
  Top 0.152: 67.81,62.93 68.82,61.92 | R16.1 75.31,55.43 PORT_FUSE.P$4 75.12,55.63 OK2.1
  Top 0.2: U$2.P$1 81.5,93 80.75,93.75
  Top 0.406: PORT_FC.4 67.81,80.31 | 67.81,80.31 68.5,81 68.5,91.5 70.75,93.75 80.75,93.75 83.22,93.75 R1.2 | 67.81,80.31 67.81,62.48 67.25,61.92
  Top 3: PORT_FUSE.P$3 PORT_FUSE.P$4 68.82,61.92 67.25,61.92 PORT_FET.SOURCE
PORT_UNFUSED
  Top 0.813: PORT_CS.IP-1 PORT_CS.IP-2
  Top 3: PORT_CS.IP-2 74.04,73.26 PORT_FUSE.P$2 PORT_FUSE.P$1
SCL
  Top 0.152: 80,3.2 EDGE_CONNECTOR.SCL_SENSOR 80.03,7.47 78.75,8.75 73.29,8.75 64.14,17.91 64.14,24.89 65.64,26.39 ADC.SCL
SDA
  Top 0.152: EDGE_CONNECTOR.SDA_SENSOR 77.5,3.19 77.5,7 76.75,7.75 71.62,7.75 71.44,7.94 | ADC.SDA 64.99,27.27 63.25,25.53 63.25,16.13 71.44,7.94 | 71.44,7.94 71.5,7.87
STBD_CURRENT  (via drill 0.35)
  Top 0.152: STBD_CS.VIOUT 17.81,93 17.81,91.96 17.34,91.48 16.48,91.48 11.18,86.18 11.18,58.67 11.96,57.89 11.96,57.13 11.25,56.42 11.25,29 12.31,27.94 20.64,27.94 21.97,29.27 21.97,38.99 24.13,41.15 v56.9,41.15 | ADC.IN0 64.34,34.6 63.88,35.05 v63.88,41.15
  Bottom 0.152: v56.9,41.15 v63.88,41.15
STBD_GATE
  Top 0.406: STBD_FC.5 38.25,81.75 37.75,81.25 37.75,75.25 40.24,72.76 STBD_FET.GATE
STBD_LOGIC  (via drill 0.35)
  Top 0.152: OK1.4 6.86,64.77 R12.2 1.78,67.31 1.78,29.84 5.08,26.54 8.89,26.54 9.27,26.16 v9.53,26.16 | v11.81,26.16 21.59,26.16 23.11,27.69 23.11,37.72 24.89,39.5 v55.24,39.5 | v65.53,39.5 65.53,34.8 65.66,34.67 65.66,33.93 ADC.IN2
  Bottom 0.152: v9.53,26.16 v11.81,26.16 | v55.24,39.5 v65.53,39.5
STBD_OPTO_NEG
  Top 0.406: OK1.2 17.53,64.01 R9.1
STBD_POWER
  Top 0.813: STBD_CS.IP+1 STBD_CS.IP+2
  Top 3: BATTERY_STBD.1 BATTERY_STBD.2 BATTERY_STBD.3 14.18,85.4 STBD_CS.IP+1
STBD_STATUS
  Top 0.406: R2.1 10.25,98 12.66,98 STBD_STATUS.ANODE
STBD_UNBALANCED
  Top 0.2: U$1.P$1 10.12,90.25 R2.2
  Top 0.406: 31.6,64.15 31.6,76.85 32.88,78.12 | STBD_FC.4 37.45,82.7 32.88,78.12 | R2.2 13.97,93.22 16.5,95.75 29.5,95.75 31.5,93.75 31.5,79.5 32.88,78.12 | OK1.1 14.48,62.1 16,60.58 25.4,60.58 | 25.4,60.58 26.46,60.58 | R15.1 22.99,60.58 25.4,60.58
  Top 3: STBD_FET.SOURCE 40.16,62 33.75,62 31.6,64.15 STBD_FUSE.P$3 26.46,60.58 STBD_FUSE.P$4
STBD_UNFUSED
  Top 0.813: STBD_CS.IP-1 STBD_CS.IP-2
  Top 3: 26.46,88 STBD_FUSE.P$1 | 26.46,88 STBD_FUSE.P$2 | STBD_CS.IP-2 26.46,88

### Text on the board
tPlace: Star Power | Kill Switch | Balanced Power | Port Power | GND | DO NOT / TOUCH | The Underwater Robotics Team / Battery Balancer -- Rev. 2.0 | Low | High | Address Resistors | A0 | A1
tNames: The Ohio State Univerity / Center for Automotive Research